# EAGLE design lap_counter_V1.1 (EAGLE 9.3.0)
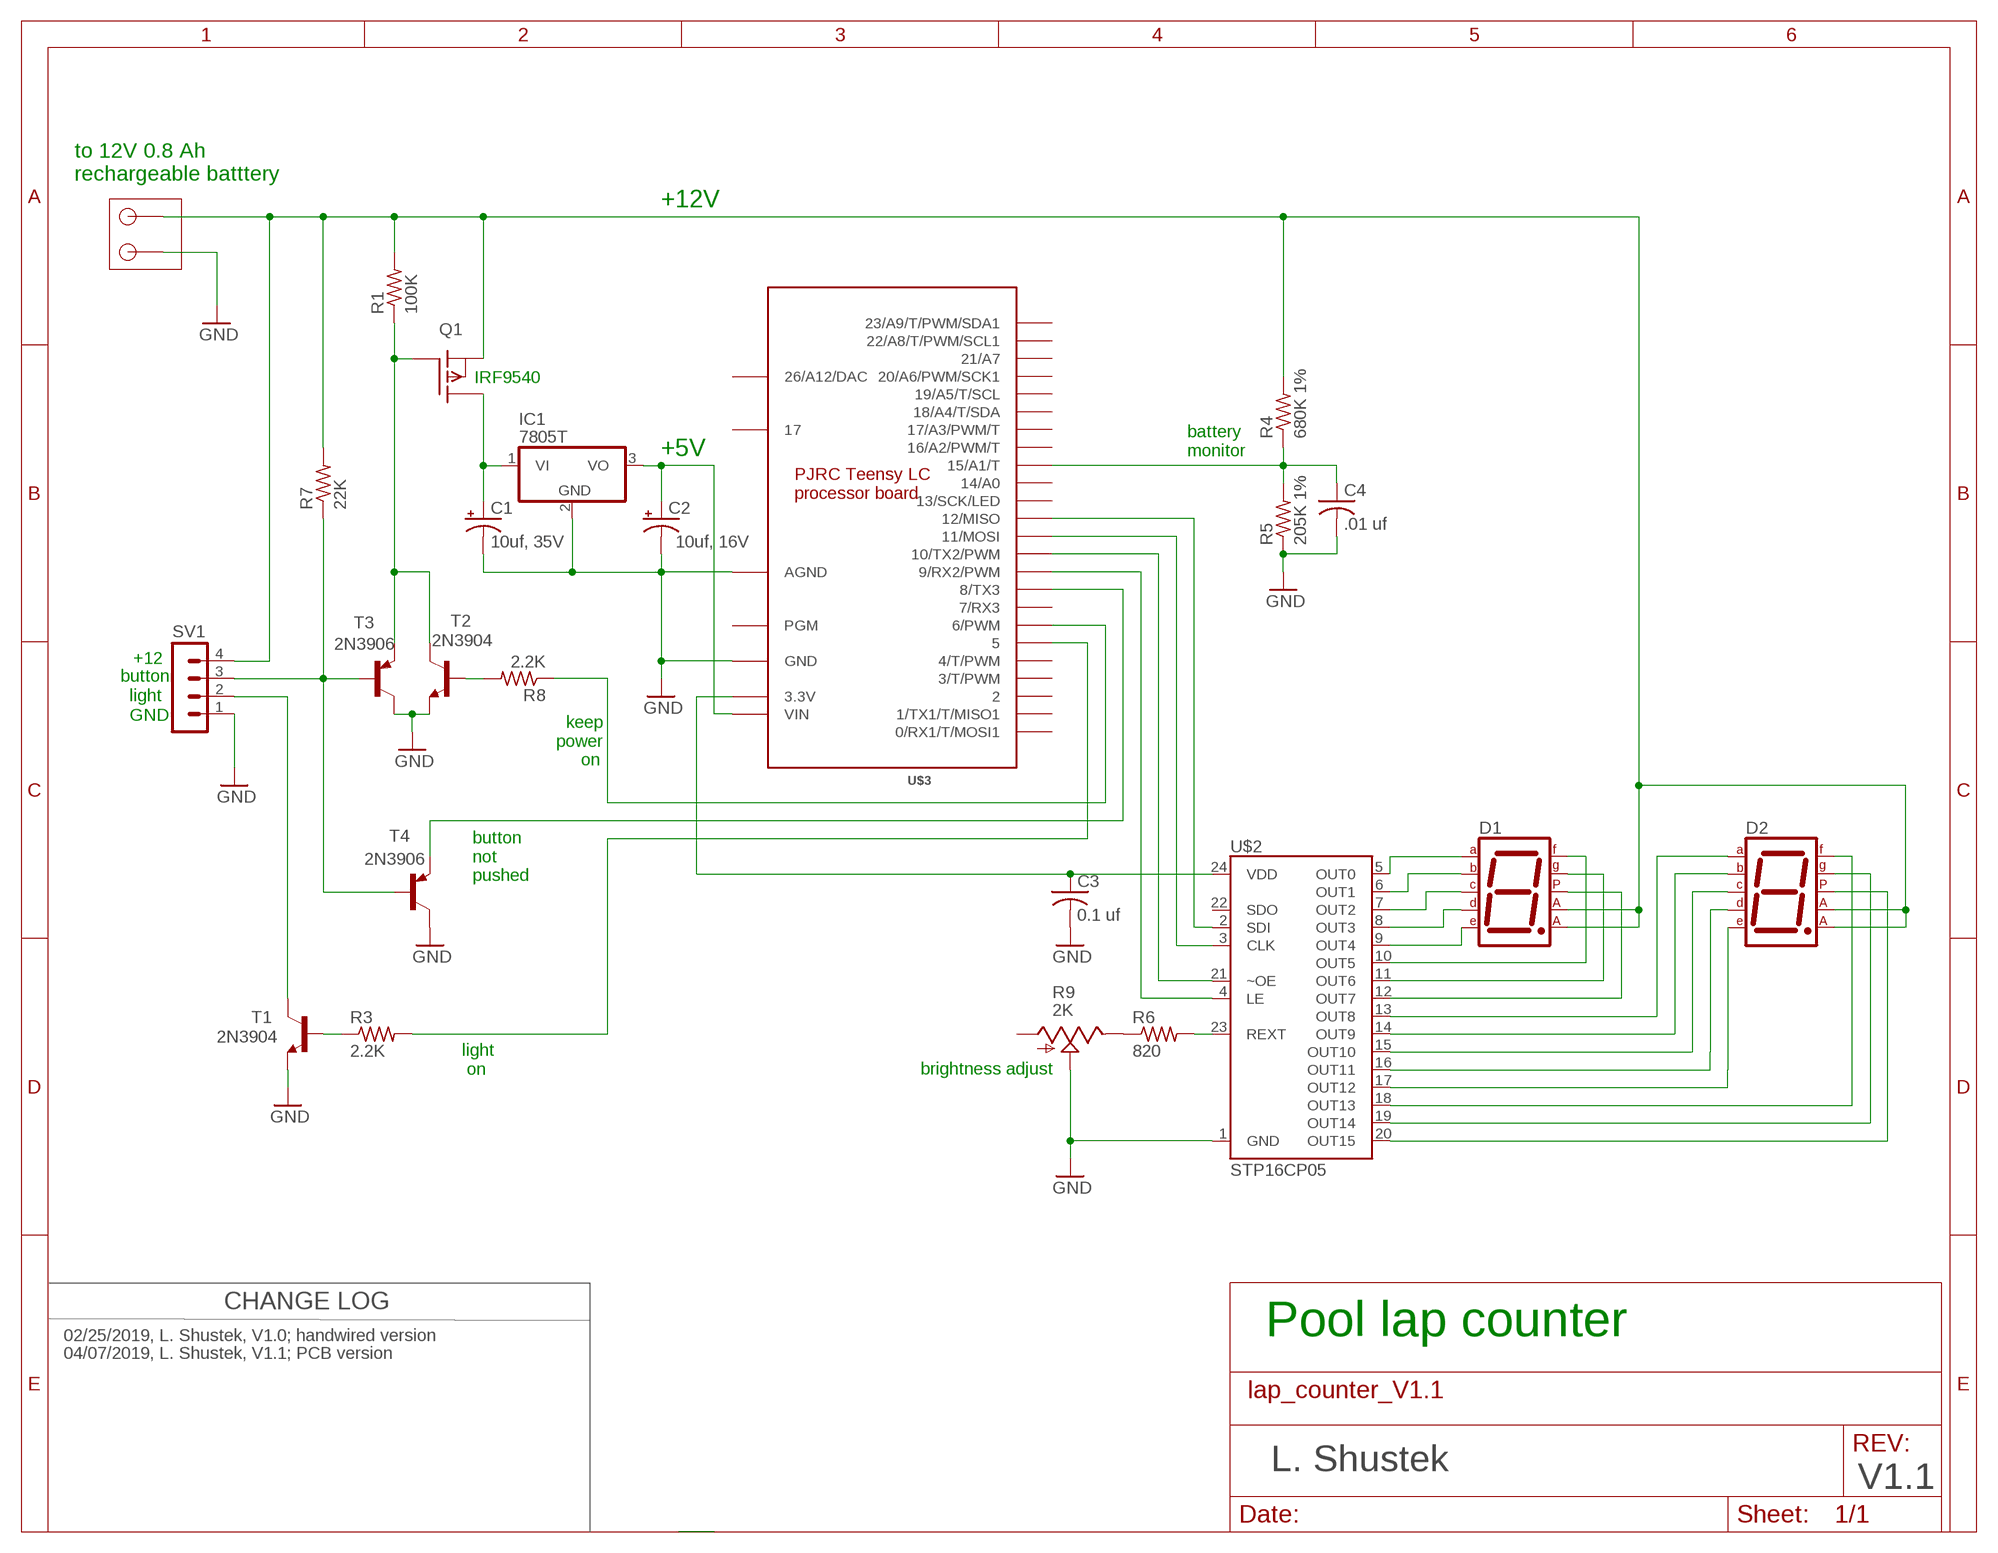
[diagram p0: schematic, sheet 1]

## Parts
C1  10uf, 35V  CPOL-USE2.5-6  [E2,5-6]
C2  10uf, 16V  CPOL-USE2.5-6  [E2,5-6]
C3  0.1 uf  C-US025-030X050  [C025-030X050]
C4  .01 uf  C-US025-030X050  [C025-030X050]
D1  7SEG-CA  [7SEG-13]
D2  7SEG-CA  [7SEG-13]
IC1  7805T  [TO220H]
Q1  IRF9530  [TO220]
R1  100K  R-US_0207/10  [0207/10]
R3  2.2K  R-US_0207/10  [0207/10]
R4  680K 1%  R-US_0207/10  [0207/10]
R5  205K 1%  R-US_0207/10  [0207/10]
R6  820  R-US_0207/10  [0207/10]
R7  22K  R-US_0207/10  [0207/10]
R8  2.2K  R-US_0207/10  [0207/10]
R9  2K  TRIM_US-B25P  [B25P]
SV1  MA04-1  [MA04-1]
T1  2N3904  2N2222  [TO92-EBC-OVAL]
T2  2N3904  2N2222  [TO92-EBC-OVAL]
T3  2N3906  2N2907  [TO92-EBC-OVAL]
T4  2N3906  2N2907  [TO92-EBC-OVAL]
U$1  CONNECTOR-2PIN  [CONNECTOR-2PIN-5MM]
U$2  STP16CP05  [SO-24DW]
U$3  TEENSY_LC_OUTER_ROW  [TEENSY3-OUTER_ROW]

## Nets
GND [power]: C1.- C2.- C3.2 C4.2 IC1.2(GND) R5.1 R9.S SV1.1 T1.E T2.E T3.C T4.C U$1.P$1 U$2.1(GND) U$3.AGND U$3.GND U$3.GND1(GND)
N$1 [power]: D1.3(CA1) D1.8(CA2) D2.3(CA1) D2.8(CA2) Q1.3(S) R1.2 R4.2 R7.2 SV1.4 U$1.P$2
N$2: C4.1 R4.1 R5.2 U$3.15/A1(15/A1/T)
N$3: Q1.1(G) R1.1 T2.C T3.E
N$4: C1.+ IC1.1(VI) Q1.2(D)
N$5 [power]: C2.+ IC1.3(VO) U$3.VIN
N$7: R3.1 T1.B
N$8: R6.1 R9.E
N$9: R6.2 U$2.23(REXT)
N$10: U$2.2(SDI) U$3.12(12/MISO)
N$11: U$2.3(CLK) U$3.11(11/MOSI)
N$12: U$2.21(~OE) U$3.10(10/TX2/PWM)
N$13: U$2.4(LE) U$3.9(9/RX2/PWM)
N$14: D1.7(A) U$2.5(OUT0)
N$15: D1.6(B) U$2.6(OUT1)
N$16: D1.4(C) U$2.7(OUT2)
N$17: D1.2(D) U$2.8(OUT3)
N$18: D1.1(E) U$2.9(OUT4)
N$19: D1.9(F) U$2.10(OUT5)
N$20: D1.10(G) U$2.11(OUT6)
N$21: D2.7(A) U$2.13(OUT8)
N$22: D2.6(B) U$2.14(OUT9)
N$23: D2.4(C) U$2.15(OUT10)
N$24: D2.2(D) U$2.16(OUT11)
N$25: D2.1(E) U$2.17(OUT12)
N$26: D2.9(F) U$2.18(OUT13)
N$27: D2.10(G) U$2.19(OUT14)
N$28: SV1.2 T1.C
N$29: R8.2 T2.B
N$30: R8.1 U$3.6(6/PWM)
N$31: R7.1 SV1.3 T3.B T4.B
N$32: D1.5(DP) U$2.12(OUT7)
N$33: R3.2 U$3.5
N$34: T4.E U$3.8(8/TX3)
N$35 [power]: C3.1 U$2.24(VDD) U$3.3.3V U$3.3.3V1(3.3V)
N$40: D2.5(DP) U$2.20(OUT15)
Unconnected: R9.A U$2.22(SDO) U$3.0(0/RX1/T/MOSI1) U$3.1(1/TX1/T/MISO1) U$3.2 U$3.3(3/T/PWM) U$3.4(4/T/PWM) U$3.7(7/RX3) U$3.13(13/SCK/LED) U$3.14/A0 U$3.16/A2(16/A2/PWM/T) U$3.17/A3(17/A3/PWM/T) U$3.18/A4(18/A4/T/SDA) U$3.19/A5(19/A5/T/SCL) U$3.20/A6(20/A6/PWM/SCK1) U$3.21/A7 U$3.22/A8(22/A8/T/PWM/SCL1) U$3.23/A9(23/A9/T/PWM/SDA1) U$3.PGM U$3.VBAT

## Notes on the sheet
- to 12V 0.8 Ah
  rechargeable batttery
- +12V
- IRF9540
- +5V
- battery
  monitor
- PJRC Teensy LC 
  processor board
- +12
- button
- light
- GND
- keep
  power
       on
- button
  not
  pushed
- light
   on
- brightness adjust
- CHANGE LOG
- Pool lap counter
- 02/25/2019, L. Shustek, V1.0; handwired version
- 04/07/2019, L. Shustek, V1.1; PCB version
- L. Shustek
- V1.1

## Power pins joined to a net without a drawn wire
26/A12/DAC: U$3.RESET/DAC(26/A12/DAC)

## Library data of the parts
C1 C2 = adafruit:CPOL-US: POLARIZED CAPACITOR, American symbol
C3 C4 = adafruit:C-US: CAPACITOR, American symbol
D1 D2 = Len:7SEG-CA: 7-segment DISPLAY single anode, 13 mm
IC1 = linear:78*: Positive VOLTAGE REGULATOR Source: http://cache.national.com/ds/LM/LM78L05.pdf http://www.fairchildsemi.com/ds/LM/LM7805.pdf
Q1 = transistor-fet:IRF9530: P-Channel Enhancement MOSFET (HEXFET); -100V; -12A; 0,3Ohm
R1 R3-R8 = resistor:R-US_: RESISTOR, American symbol
R9 = pot:TRIM_US-: POTENTIOMETER
SV1 = con-lstb:MA04-1: PIN HEADER; OC_FARNELL: unknown; OC_NEWARK: unknown
T1 T2 = adafruit:2N2222: NPN TRANSISTOR Big oval pads
T3 T4 = adafruit:2N2907*: PNP Transistor Big Oval pads
U$1 = Len:CONNECTOR-2PIN
U$2 = SparkFun-Retired:STP16CP05: 16-pin constant current sink shift register LED driver Not in catalog
U$3 = Teensy_3_and_LC_Series_Boards_v1.0:TEENSY_LC_OUTER_ROW: Teensy LC with only outer row of pins.

## Net classes
0 default: width 0.381 mm, clearance 0.254 mm
1 power: width 0.508 mm, clearance 0.254 mm to class 0, clearance 0.254 mm

## Board
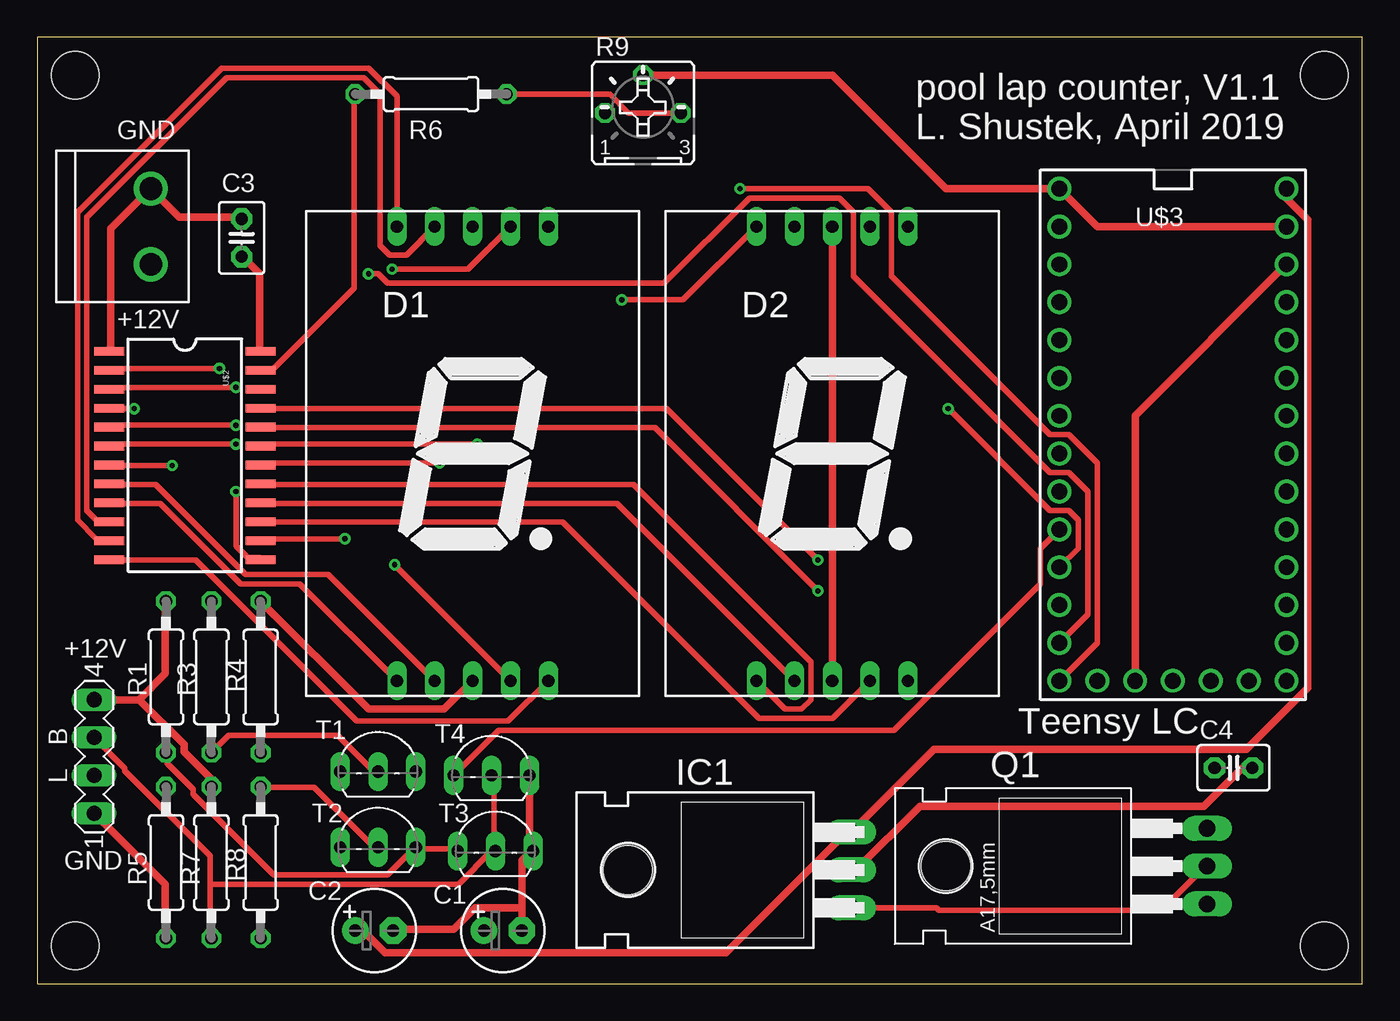
[diagram p1: board, top side]
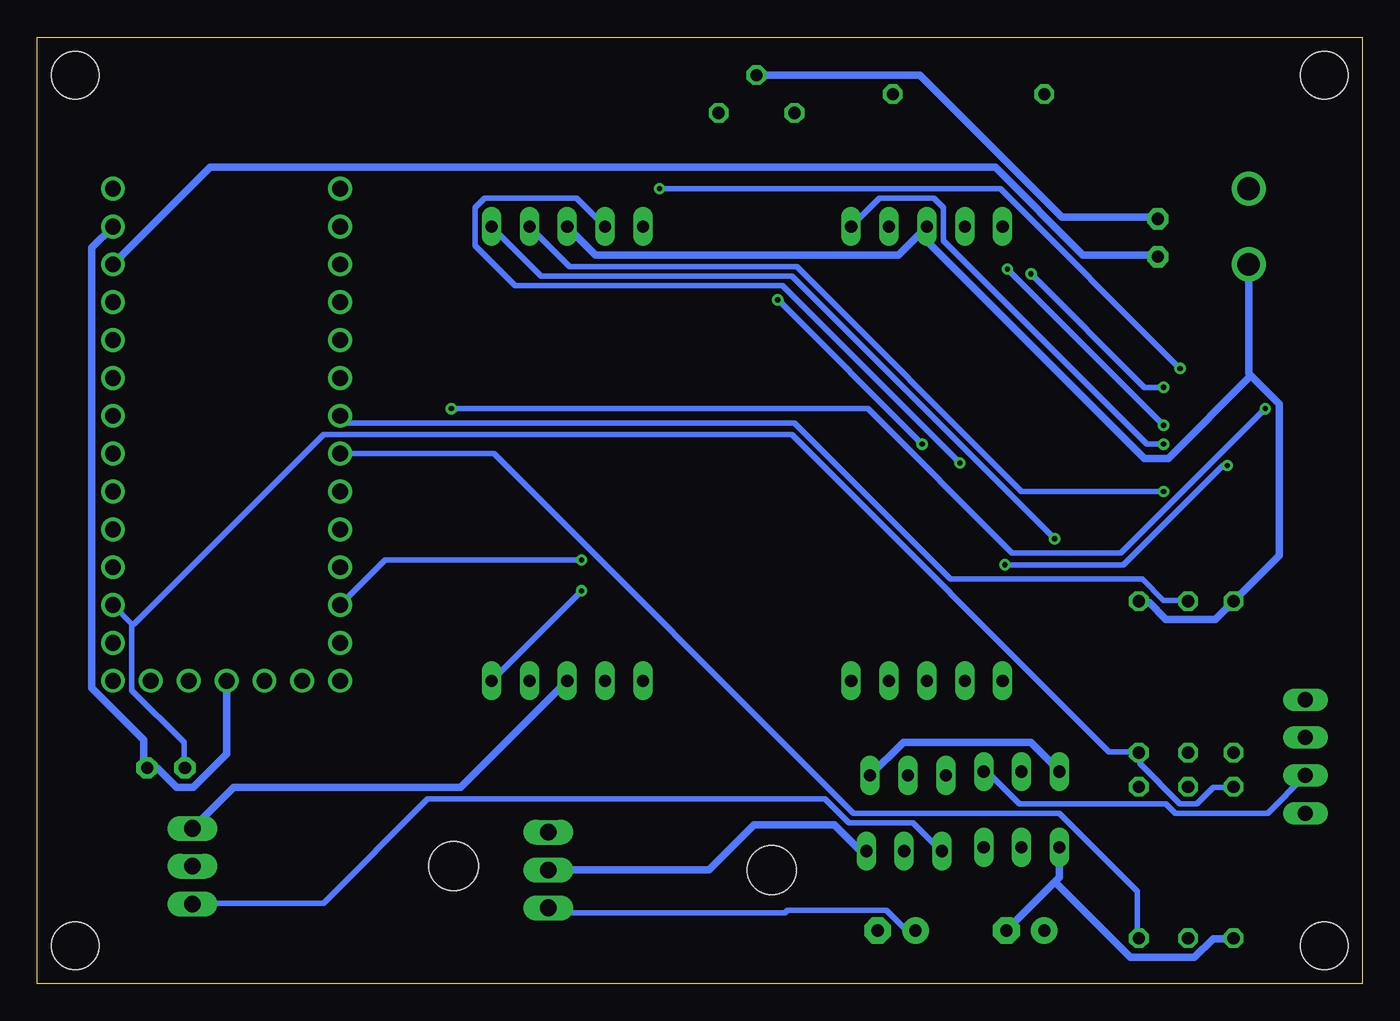
[diagram p2: board, bottom side, seen from below]

Size 88.9 x 63.5 mm. Coordinates in mm from the lower left corner, seen from the top.
Outline: 0,0 88.9,0 88.9,63.5 0,63.5 0,0
Copper layers (1*16): Top 0.035mm / dielectric 1.5mm / Bottom 0.035mm
Design rules "default *": minimum track width 12mil, minimum drill 0.35mm, track to track 6mil, track to pad 6mil, pad to pad 6mil, via to via 6mil, smd to smd 6mil, copper to edge 40mil, drill to drill 6mil, minimum pad ring 10mil, minimum via ring 8mil, stop-mask expansion 4mil, vias tented up to drill 0mil, thermal gap 10mil
Holes 3.17 mm at 2.54,2.54 2.54,60.96 86.36,60.96 86.36,2.54

### Footprints (pad centres in the part's own frame; a part is rotated, then mirrored left to right if it is on the bottom)
E2,5-6 = drill 0.813 pad 1.778: + -1.27,0 | drill 0.813 pad 1.778 octagon: - 1.27,0
C025-030X050 = drill 0.813 pad 1.422 octagon: 1 -1.27,0; 2 1.27,0
7SEG-13 = drill 0.813 long: 1 -5.08,-15.24; 2 -2.54,-15.24; 3 0,-15.24; 4 2.54,-15.24; 5 5.08,-15.24; 6 5.08,15.24; 7 2.54,15.24; 8 0,15.24; 9 -2.54,15.24; 10 -5.08,15.24
TO220H = drill 1.118 long: 1 -2.54,-10.16; 2 0,-10.16; 3 2.54,-10.16 | hole 3.302: 0,4.826
TO220 = drill 1.118 long: 1 -2.54,-6.35; 2 0,-6.35; 3 2.54,-6.35 | hole 3.302: 0,11.176
0207/10 = drill 0.813 octagon: 1 -5.08,0; 2 5.08,0
B25P = drill 0.813 octagon: A -2.54,0; E 2.54,0; S 0,2.54
MA04-1 = drill 1.016 long: 1 -3.81,0; 2 -1.27,0; 3 1.27,0; 4 3.81,0
TO92-EBC-OVAL = drill 0.813 long: B 0,-1.27; C 2.54,-1.27; E -2.54,-1.27
CONNECTOR-2PIN-5MM = drill 1.524: P$1 0,2.54; P$2 0,-2.54
SO-24DW = smd 0.584 x 2.032: 1 -6.35,-5.08; 2 -5.08,-5.08; 3 -3.81,-5.08; 4 -2.54,-5.08; 5 -1.27,-5.08; 6 0,-5.08; 7 1.27,-5.08; 8 2.54,-5.08; 9 3.81,-5.08; 10 5.08,-5.08; 11 6.35,-5.08; 12 7.62,-5.08; 13 7.62,5.08; 14 6.35,5.08; 15 5.08,5.08; 16 3.81,5.08; 17 2.54,5.08; 18 1.27,5.08; 19 0,5.08; 20 -1.27,5.08; 21 -2.54,5.08; 22 -3.81,5.08; 23 -5.08,5.08; 24 -6.35,5.08
TEENSY3-OUTER_ROW = drill 1.067: 0 -7.62,13.97; 1 -7.62,11.43; 2 -7.62,8.89; 3 -7.62,6.35; 3.3V 7.62,11.43; 3.3V1 -2.54,-16.51; 4 -7.62,3.81; 5 -7.62,1.27; 6 -7.62,-1.27; 7 -7.62,-3.81; 8 -7.62,-6.35; 9 -7.62,-8.89; 10 -7.62,-11.43; 11 -7.62,-13.97; 12 -7.62,-16.51; 13 7.62,-16.51; 14/A0 7.62,-13.97; 15/A1 7.62,-11.43; 16/A2 7.62,-8.89; 17/A3 7.62,-6.35; 18/A4 7.62,-3.81; 19/A5 7.62,-1.27; 20/A6 7.62,1.27; 21/A7 7.62,3.81; 22/A8 7.62,6.35; 23/A9 7.62,8.89; AGND 7.62,13.97; GND -7.62,16.51; GND1 0,-16.51; PGM 2.54,-16.51; RESET/DAC 5.08,-16.51; VBAT -5.08,-16.51; VIN 7.62,16.51

### Placement (x,y rotation side)
C1  31.24,3.56 0 top
C2  22.61,3.56 0 top
C3  13.72,50.04 90 top
C4  80.26,14.48 0 top
D1  29.21,35.56 0 top
D2  53.34,35.56 0 top
IC1  44.45,7.62 90 top
Q1  72.14,7.87 90 top
R1  8.64,20.57 90 top
R3  11.68,20.57 90 top
R4  14.99,20.57 90 top
R5  8.64,8.13 90 top
R6  26.42,59.69 180 top
R7  11.68,8.13 90 top
R8  14.99,8.13 90 top
R9  40.64,58.42 0 top
SV1  3.81,15.24 90 top
T1  22.86,15.49 0 top
T2  22.86,10.41 0 top
T3  30.73,10.16 0 top
T4  30.48,15.24 0 top
U$1  7.62,50.8 0 top
U$2  9.91,36.07 270 top
U$3  76.2,36.83 0 top

### Tracks (layer width: path | path; a pad name or v marks a point on that pad's centre or on a via)
GND
  Top 0.508: SV1.1 8.57,6.67 8.57,3.17 R5.1 | T4.C 33.02,9.05 33.18,8.89 T3.C 33.02,8.73 32.54,8.26 32.54,5.08 | 32.54,5.08 32.54,3.65 C1.- | 32.54,5.08 29.37,5.08 27.94,3.65 23.97,3.65 C2.- | IC1.2 54.93,7.62 59.21,11.91 78.26,11.91 80.8,14.45 81.44,14.45 C4.2 | U$2.1 4.92,42.55 4.92,50.64 U$1.P$1 9.53,51.44 13.65,51.44 C3.2 | R9.S 53.34,60.96 60.96,53.34 U$3.GND 71.12,50.8 U$3.AGND
  Bottom 0.508: U$3.GND1 76.2,15.4 78.42,13.18 79.53,13.18 80.8,14.45 81.44,14.45 C4.2 81.76,14.61 81.76,16.35 85.25,19.84 85.25,49.37 U$3.AGND | T2.E 20.32,7.14 20.64,6.83 | 20.64,6.83 23.81,3.65 C2.- | T4.C 30.8,16.19 22.23,16.19 20.32,14.29 T1.E | IC1.2 43.81,7.62 40.8,10.64 35.4,10.64 33.66,8.89 T3.C | 20.64,6.83 15.56,1.75 11.27,1.75 10,3.02 8.73,3.02 R5.1 | R9.S 29.69,60.96 20.16,51.44 13.81,51.44 C3.2
N$1
  Top 0.508: D1.3 27.3,18.41 22.23,18.41 R4.2 | 6.83,19.05 9.84,16.03 9.84,15.56 11.59,13.81 11.59,13.34 R7.2 | SV1.4 6.83,19.05 | 6.83,19.05 8.57,20.8 8.57,25.56 R1.2 | D2.3 D2.8
  Bottom 0.508: U$1.P$2 7.62,40.96 7.46,40.8 | 7.46,40.8 5.56,38.89 5.56,28.73 R1.2 9.84,24.45 13.18,24.45 14.29,25.56 14.92,25.56 R4.2 | D2.8 51.44,48.9 31.11,48.9 D1.8 29.53,50.16 14.61,35.24 13.02,35.24 7.46,40.8 | D2.3 60.48,13.18 75.72,13.18 Q1.3
N$2
  Bottom 0.381: R5.2 8.73,13.18 10,13.18 11.11,12.06 12.22,12.06 14.92,14.76 14.92,15.4 R4.1 15.08,15.56 16.99,15.56 38.26,36.83 69.69,36.83 82.39,24.13 82.55,24.13 | 82.55,24.13 82.55,19.68 79.06,16.19 79.06,14.61 C4.1 | U$3.15/A1 82.55,24.13
N$3
  Top 0.381: T3.E 28.1,8.89 27.94,9.05 25.4,9.05 T2.C 25.24,9.05 23.5,7.3 15.88,7.3 10.48,12.7 10.48,13.02 8.73,14.76 8.73,15.4 R1.1
  Bottom 0.381: Q1.1 78.42,5.4 69.69,5.4 62.71,12.38 36.04,12.38 34.45,10.79 30.16,10.79 28.26,8.89 T3.E
N$4
  Top 0.381: IC1.1 60.33,5.08 60.48,4.92 75.41,4.92 78.42,7.94 Q1.2
  Bottom 0.381: IC1.1 54.29,4.76 38.73,4.76 38.58,4.92 31.91,4.92 30.64,3.65 30,3.65 C1.+
N$5
  Top 0.508: U$3.VIN 83.82,52.7 85.25,51.28 85.25,19.84 81.12,15.72 60.17,15.72 IC1.3 54.45,10.32 46.2,2.06 23.34,2.06 21.91,3.49 21.43,3.49 C2.+
N$7
  Top 0.381: R3.1 12.86,16.67 20.16,16.67 22.54,14.29 22.86,14.29 T1.B
N$8
  Top 0.381: R9.E 39.69,58.42 38.42,59.69 R6.1
N$9
  Top 0.381: U$2.23 15.08,41.27 15.88,41.27 21.27,46.67 21.27,59.69 R6.2
N$10  (via drill 0.35)
  Top 0.381: v12.22,41.27 4.92,41.27 U$2.2 | v47.15,53.34 55.72,53.34 57.31,51.75 57.31,47.47 67.94,36.83 69.22,36.83 71.12,34.92 71.12,22.86 U$3.12
  Bottom 0.381: v12.22,41.27 24.29,53.34 v47.15,53.34
N$11  (via drill 0.35)
  Top 0.381: v13.34,40.01 4.92,40.01 U$2.3 | v22.23,47.62 22.86,47.62 23.5,46.99 42.07,46.99 47.78,52.7 53.82,52.7 54.77,51.75 54.77,47.47 67.94,34.29 69.22,34.29 70.48,33.02 70.48,24.77 U$3.11
  Bottom 0.381: v13.34,40.01 14.61,40.01 v22.23,47.62
N$12  (via drill 0.35)
  Top 0.381: v52.39,28.42 42.23,38.58 15.08,38.58 U$2.21
  Bottom 0.381: v52.39,28.42 65.56,28.42 U$3.10
N$13  (via drill 0.35)
  Top 0.381: v6.51,38.58 4.92,38.58 U$2.4 | v61.12,38.58 67.94,31.75 69.22,31.75 69.85,31.11 69.85,29.21 U$3.9
  Bottom 0.381: v6.51,38.58 16.19,28.89 23.5,28.89 33.18,38.58 v61.12,38.58
N$14  (via drill 0.35)
  Top 0.381: v13.34,37.47 4.92,37.47 U$2.5 | v23.81,47.94 28.89,47.94 D1.7
  Bottom 0.381: v23.81,47.94 v13.34,37.47
N$15  (via drill 0.35)
  Top 0.381: v13.34,36.2 4.92,36.2 U$2.6
  Bottom 0.381: v13.34,36.2 14.45,36.2 28.1,49.85 28.1,52.07 28.73,52.7 32.38,52.7 D1.6
N$16  (via drill 0.35)
  Top 0.381: v9.05,34.77 4.92,34.77 U$2.7 | D1.4 v23.97,28.1
  Bottom 0.381: v9.05,34.77 9.37,34.77 16.03,28.1 v23.97,28.1
N$17
  Top 0.381: D1.2 19.53,27.46 13.97,27.46 7.94,33.5 4.92,33.5 U$2.8
N$18
  Top 0.381: D1.1 17.62,26.83 13.65,26.83 8.26,32.23 4.92,32.23 U$2.9
N$19
  Top 0.381: D1.9 24.77,48.9 23.65,48.9 23.02,49.53 23.02,59.69 21.91,60.8 12.7,60.8 3.33,51.44 3.33,31.75 3.97,31.11 4.76,31.11 U$2.10
N$20
  Top 0.381: D1.10 24.13,59.53 22.23,61.44 12.38,61.44 2.7,51.75 2.7,31.11 3.97,29.84 4.76,29.84 U$2.11
N$21  (via drill 0.35)
  Top 0.381: v13.34,33.02 13.34,29.37 14.13,28.57 14.92,28.57 U$2.13
  Bottom 0.381: v13.34,33.02 22.86,33.02 37.94,48.1 53.18,48.1 D2.7
N$22  (via drill 0.35)
  Top 0.381: v20.64,29.84 15.08,29.84 U$2.14
  Bottom 0.381: v20.64,29.84 38.26,47.47 55.09,47.47 D2.6
N$23
  Top 0.381: D2.4 53.34,17.78 48.42,17.78 35.24,30.96 15.08,30.96 U$2.15
N$24
  Top 0.381: D2.2 38.89,32.23 15.08,32.23 U$2.16
N$25
  Top 0.381: D2.1 50.16,18.41 51.28,18.41 51.91,19.05 51.91,21.59 40.01,33.5 15.08,33.5 U$2.17
N$26  (via drill 0.35)
  Top 0.381: v26.99,34.92 15.08,34.92 U$2.18
  Bottom 0.381: v26.99,34.92 38.89,46.83 56.83,46.83 59.53,49.53 59.53,52.07 58.9,52.7 52.7,52.7 D2.9
N$27  (via drill 0.35)
  Top 0.381: v29.53,36.2 15.08,36.2 U$2.19 | v39.21,45.88 43.34,45.88 D2.10
  Bottom 0.381: v39.21,45.88 v29.53,36.2
N$28
  Bottom 0.381: SV1.2 6.35,11.43 12.54,11.43 13.18,12.06 23.02,12.06 25.08,14.13 25.4,14.13 T1.C
N$29
  Top 0.381: T2.B 22.86,9.21 22.54,9.21 18.57,13.18 15.08,13.18 R8.2
N$30
  Bottom 0.381: U$3.6 58.26,35.56 34.13,11.43 20.32,11.43 15.08,6.19 15.08,3.17 R8.1
N$31
  Top 0.381: T4.B 30.64,13.81 30.64,8.89 T3.B 30.48,8.89 28.26,6.67 11.59,6.67 | 11.59,6.67 11.59,8.57 5.87,14.29 5.87,14.45 SV1.3 | 11.59,6.67 11.59,3.17 R7.1
N$32
  Top 0.381: D1.5 31.59,17.62 21.43,17.62 10.64,28.42 4.92,28.42 U$2.12
N$33
  Bottom 0.381: U$3.5 68.1,37.62 38.1,37.62 27.62,27.15 14.76,27.15 13.34,25.72 11.75,25.72 R3.2
N$34
  Top 0.381: T4.E 30.96,16.99 57.47,16.99 67.31,26.83 67.31,29.21 U$3.8
N$35
  Top 0.508: U$2.24 14.92,42.55 14.92,47.62 13.81,48.74 C3.1 | U$3.3.3V1 73.66,38.1 U$3.3.3V
  Bottom 0.508: U$3.3.3V 77.31,54.77 24.61,54.77 18.73,48.9 13.81,48.9 C3.1
N$40  (via drill 0.35)
  Top 0.381: v52.39,26.35 41.43,37.31 15.08,37.31 U$2.20
  Bottom 0.381: D2.5 v52.39,26.35

### Text on the board
tPlace: GND | pool lap counter, V1.1 / L. Shustek, April 2019 | +12V | +12V | Teensy LC | B | L | GND